# Altium project HVDC Altium.PrjPcb
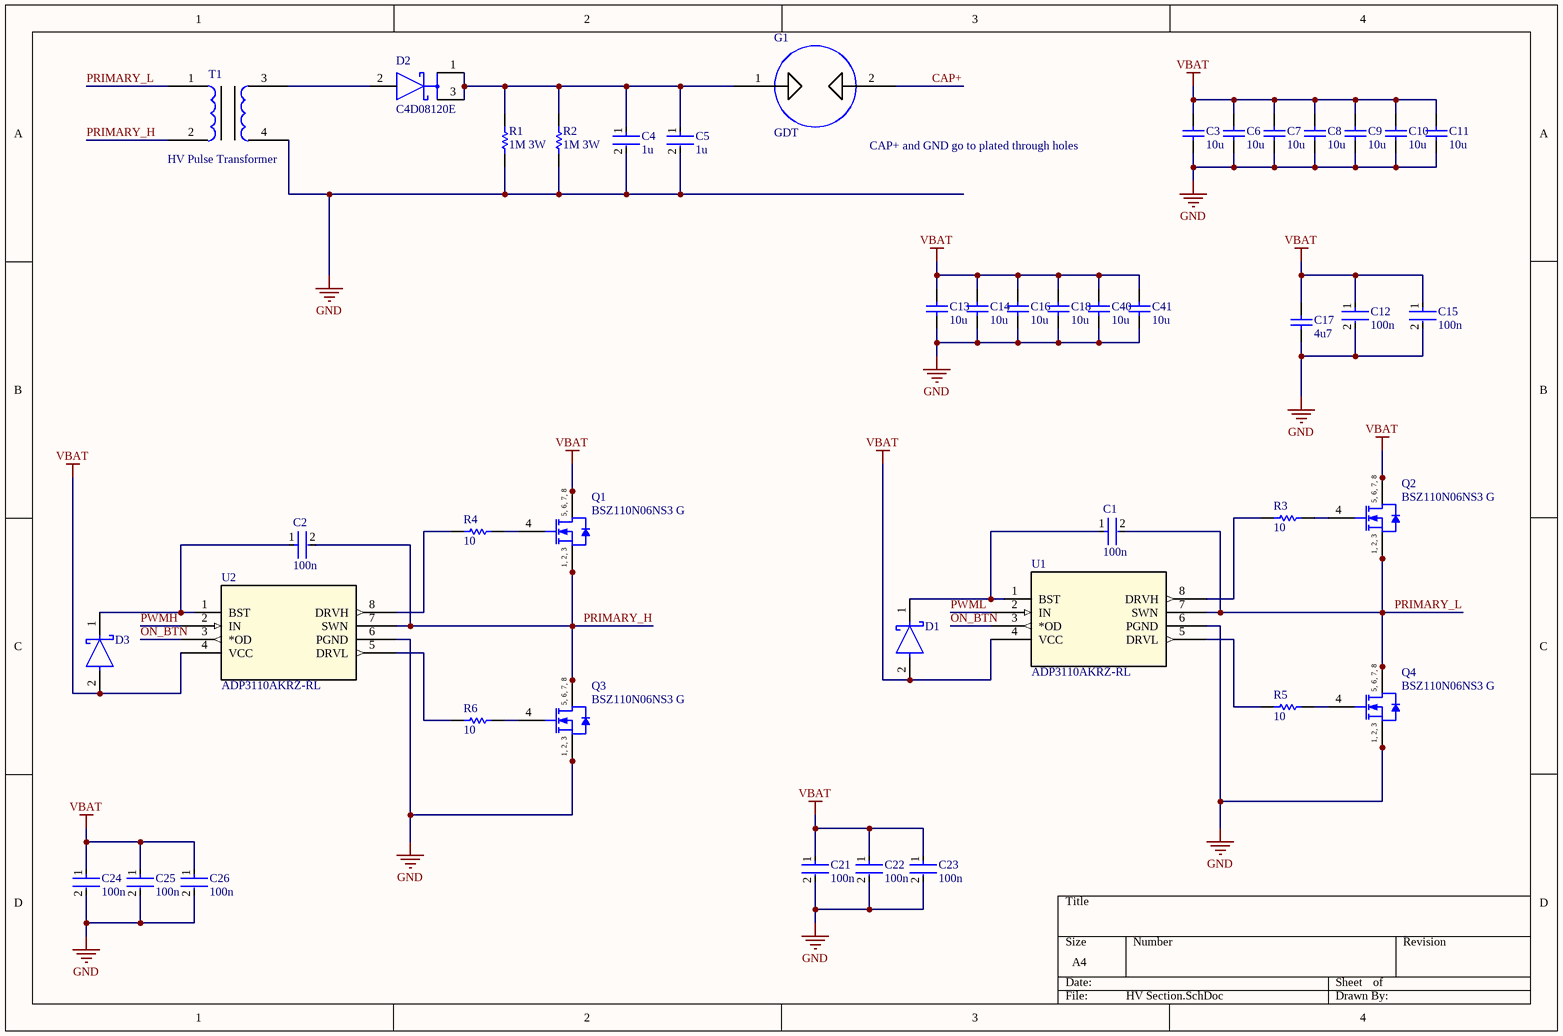
[diagram p0: HV Section.SchDoc]
3 sheets, 87 parts. Net scope: global (net labels, ports and power ports of the same name join across sheets).
Board file: PCB1.PcbDoc
Sheets:
  HV Section.SchDoc
  STM32.SchDoc
  Power.SchDoc

## Sheet HV Section.SchDoc
size A4; SheetNumber: 1; SheetTotal: 2

### Parts
C1  100n  [FP-GRM188-0_1-e0_2_0_55-IPC_A]
C2  100n  [FP-GRM188-0_1-e0_2_0_55-IPC_A]
C3  10u  [CAPC2013X145X50ML20T25]
C4  1u  [FP-C4AQSBU4100A1WJ-MFG]
C5  1u  [FP-C4AQSBU4100A1WJ-MFG]
C6  10u  [CAPC2013X145X50ML20T25]
C7  10u  [CAPC2013X145X50ML20T25]
C8  10u  [CAPC2013X145X50ML20T25]
C9  10u  [CAPC2013X145X50ML20T25]
C10  10u  [CAPC2013X145X50ML20T25]
C11  10u  [CAPC2013X145X50ML20T25]
C12  100n  [FP-GRM188-0_1-e0_2_0_55-IPC_A]
C13  10u  [CAPC2013X145X50ML20T25]
C14  10u  [CAPC2013X145X50ML20T25]
C15  100n  [FP-GRM188-0_1-e0_2_0_55-IPC_A]
C16  10u  [CAPC2013X145X50ML20T25]
C17  4u7  [CAPC2013X145X50ML20T25]
C18  10u  [CAPC2013X145X50ML20T25]
C21  100n  [FP-GRM188-0_1-e0_2_0_55-IPC_A]
C22  100n  [FP-GRM188-0_1-e0_2_0_55-IPC_A]
C23  100n  [FP-GRM188-0_1-e0_2_0_55-IPC_A]
C24  100n  [FP-GRM188-0_1-e0_2_0_55-IPC_A]
C25  100n  [FP-GRM188-0_1-e0_2_0_55-IPC_A]
C26  100n  [FP-GRM188-0_1-e0_2_0_55-IPC_A]
C40  10u  [CAPC2013X145X50ML20T25]
C41  10u  [CAPC2013X145X50ML20T25]
D1  SD0603S040S0R2  [FP-SD0603-MFG]  (value not drawn)
D2  C4D08120E  [FP-TO-252-2_v2-MFG]
D3  SD0603S040S0R2  [FP-SD0603-MFG]  (value not drawn)
G1  GDT  [2039-110-SM-RPLF]
Q1  BSZ110N06NS3 G  [INF-PG-TSDSON-8-21_V]
Q2  BSZ110N06NS3 G  [INF-PG-TSDSON-8-21_V]
Q3  BSZ110N06NS3 G  [INF-PG-TSDSON-8-21_V]
Q4  BSZ110N06NS3 G  [INF-PG-TSDSON-8-21_V]
R1  1M 3W  [RESC2512(6432)_L]
R2  1M 3W  [RESC2512(6432)_L]
R3  10  [RESC1608X55X25ML10T15]
R4  10  [RESC1608X55X25ML10T15]
R5  10  [RESC1608X55X25ML10T15]
R6  10  [RESC1608X55X25ML10T15]
T1  HV Pulse Transformer  [HV Pulse Transformer Footprint]
U1  ADP3110AKRZ-RL  [SOIC8_ONS]
U2  ADP3110AKRZ-RL  [SOIC8_ONS]

### Nets
GND: C3.1 C4.2 C5.2 C6.1 C7.1 C8.1 C9.1 C10.1 C11.1 C12.2 C13.1 C14.1 C15.2 C16.1 C17.1 C18.1 C21.2 C22.2 C23.2 C24.2 C25.2 C26.2 C40.1 C41.1 Q3.1(SOURCE) Q3.2(SOURCE) Q3.3(SOURCE) Q4.1(SOURCE) Q4.2(SOURCE) Q4.3(SOURCE) R1.1 R2.1 T1.4 U1.6(PGND) U2.6(PGND)
VBAT: C3.2 C6.2 C7.2 C8.2 C9.2 C10.2 C11.2 C12.1 C13.2 C14.2 C15.1 C16.2 C17.2 C18.2 C21.1 C22.1 C23.1 C24.1 C25.1 C26.1 C40.2 C41.2 D1.2(A) D3.2(A) Q1.5(DRAIN) Q1.6(DRAIN) Q1.7(DRAIN) Q1.8(DRAIN) Q2.5(DRAIN) Q2.6(DRAIN) Q2.7(DRAIN) Q2.8(DRAIN) U1.4(VCC) U2.4(VCC)
CAP+: G1.2
ON_BTN: U1.3(*OD) U2.3(*OD)
PRIMARY_H: C2.2 Q1.1(SOURCE) Q1.2(SOURCE) Q1.3(SOURCE) Q3.5(DRAIN) Q3.6(DRAIN) Q3.7(DRAIN) Q3.8(DRAIN) T1.2 U2.7(SWN)
PRIMARY_L: C1.2 Q2.1(SOURCE) Q2.2(SOURCE) Q2.3(SOURCE) Q4.5(DRAIN) Q4.6(DRAIN) Q4.7(DRAIN) Q4.8(DRAIN) T1.1 U1.7(SWN)
PWMH: U2.2(IN)
PWML: U1.2(IN)
NetC1_1: C1.1 D1.1(C) U1.1(BST)
NetC2_1: C2.1 D3.1(C) U2.1(BST)
NetC4_1: C4.1 C5.1 D2.1(C) D2.3(C) G1.1 R1.2 R2.2
NetD2_2: D2.2(A) T1.3
NetQ1_4: Q1.4(GATE) R4.2
NetQ2_4: Q2.4(GATE) R3.2
NetQ3_4: Q3.4(GATE) R6.2
NetQ4_4: Q4.4(GATE) R5.2
NetR3_1: R3.1 U1.8(DRVH)
NetR4_1: R4.1 U2.8(DRVH)
NetR5_1: R5.1 U1.5(DRVL)
NetR6_1: R6.1 U2.5(DRVL)

### Notes on the sheet
- CAP+ and GND go to plated through holes
- (in symbol CMP-1091-00315-1) 5, 6, 7, 8; 1, 2, 3

### Library data of the parts
C1 C2 C12 C15 C21-C26 = CMP-2006-02792-2: Chip Multilayer Ceramic Capacitors for General Purpose, 0603, 10uF, X5R, 15%, 20%, 6.3V; Packaging: Tape and Reel; Voltage Rating (DC): 6.3V; Width: 0.031inch; Termination: SMD/SMT; Dielectric: X5R; Package Quantity: 4000; Voltage Rating: 6.3V; Capacitance: 10uF; Case/Package: 0603; Min Operating Temperature: -55°C; Voltage: 6.3V; Length: 1.6mm; Thickness: 0.035inch; Lead Free: Lead Free; Depth: 0.8mm; Case Code (Imperial): 0603; Max Operating Temperature: 85°C; Material: Ceramic; Height: 0.8mm; Tolerance: 20%; Mount: Surface Mount; REACH SVHC: No SVHC; Radiation Hardening: No; Case Code (Metric): 1608
C3 C6-C11 C13 C14 C16-C18 C40 C41 = CMP-1036-04819-2: Part Number: C0805C225K9PACTU; Manufacturer: Kemet
C4 C5 = CMP-00212-89953900-1: C4AQSBU4100A1WJ Cap Film 1uF 1500V Polypropylene 5% Molded 27.5mm 105°C; Voltage Rating: 1.5kV; Voltage Rating (DC): 1.5V; Capacitance: 1µF; NexarPartId: 89953900; Min Operating Temperature: -55°C; Max Operating Temperature: 105°C; Case/Package: Radial; Height: 20.2mm; Schedule B: 8532250070; Tolerance: 5%
D1 D3 = CMP-04549-000001-1: DIODE SCHOTTKY 40V 200MA 0603; Manufacturer: AVX; Max Surge Forward Current: 2A; Forward Current: 0.2A; Lead Free: Yes; Reverse Voltage: 40V; Temperature Range Low: -55°C; Device Class L1: Discrete Semiconductors; Category: Diode; ComponentLink2URL: http://datasheets.avx.com/schottky.pdf; Device Class L3: Schottky Diodes; Automotive: No; Temperature Range High: +125°C; Digikey Description: DIODE SCHOTTKY 40V 200MA 0603; Device Class L2: Diodes; ComponentLink2Description: Datasheet; Max Repetitive Reverse Voltage: 40V; Mouser Description: Schottky Diodes & Rectifiers 40volts 0.2A SIZE 0603; Height: 0.86mm; Temperature: -55°C to +125°C; Manufacturer Part Number: SD0603S040S0R2; Package: SD0603; RoHS: TRUE; Octopart: https://octopart.com/sd0603s040s0r2-avx-24931763
D2 = CMP-240925-000081-2: DIODE SCHOTTKY 1.2KV 8A TO252-2; Max Surge Current: 64A; Max Reverse Leakage Current: 35uA; Forward Current: 24.5A; Max Power Dissipation: 136W; Reverse Recovery Time: 0ns; Forward Voltage: 1.8V; Element Configuration: Single; Mount: Surface Mount; Min Operating Temperature: -55°C; Case/Package: TO-252; Peak Non-Repetitive Surge Current: 64A; Max Repetitive Reverse Voltage (Vrrm): 1.2kV; Max Forward Surge Current (Ifsm): 64A; Max Reverse Voltage (DC): 1.2kV; Package Quantity: 75; Average Rectified Current: 24.5A; Max Operating Temperature: 175°C; Series: Z-Rec®; Number of Pins: 3; RoHS Compliant: Yes; Packaging: Rail/Tube
Q1-Q4 = CMP-1091-00315-1: N-Channel OptiMOS 3 Power-Transistor, 60 V VDS, 20 A ID, -55 to 150 degC, PG-TSDSON-8-21, Reel, Green; Manufacturer: Infineon; Green: TRUE; ID (max): 20Â A; Ptot (max): 50Â W; QG: 25Â nC; Rth: 2.5Â K/W; IDpuls (max): 80Â A; RthJA (max): 60 K/W; VDS (max): 60Â V; VGS(th) (max): 4Â V; Polarity: N; RDS (on) (max): 11Â mOhm; VGS(th) (min): 2Â V; PackageVersion: Rev. 01, 03/2007; Mounting Technology: Surface Mount; DatasheetVersion: Rev. 2.4; ComponentLink1URL: http://www.infineon.com/; ComponentLink3Description: Package Specification; ComponentLink3URL: http://www.infineon.com/dgdl/BSZ110N06NS3_Rev2.4.pdf?folderId=db3a30431ddc9372011ebafa04517f8b&fileId=db3a30431ddc9372011ebb15d4e8001a; Packing: Reel; PartNumber: BSZ110N06NS3 G; PackageDescription: 8-Pin Plastic (Green) Small Outline Non-Leaded Package, 3.3 x 3.3 mm Body, 0.65 mm Pitch; ComponentLink2URL: http://www.infineon.com/dgdl/BSZ110N06NS3_Rev2.4.pdf?folderId=db3a30431ddc9372011ebafa04517f8b&fileId=db3a30431ddc9372011ebb15d4e8001a; PackageReference: PG-TSDSON-8-21; Halogen-free: TRUE; RthJC (max): 2.5Â K/W; ComponentLink2Description: Datasheet; ComponentLink1Description: Manufacturer URL
R1 R2 = CMP-1018-00001-1: Jumper 2512 (6432 Metric); Tolerance: None; Case-EIA: 2512; Value: 0.00 Ohm; Case-Metric: 6432; Technology: SMT; Power: None
R3-R6 = CMP-2100-03667-1: Chip Resistor, 0 Ohm, +/- 5%, 0.1 W, -55 to 155 degC, 0603 (1608 Metric), RoHS, Tape and Reel; Manufacturer: Yageo; Temperature Coefficient: 200ppm/degreesC; Voltage Rating: 50V; Power Rating: 100mW; Resistance: 0mOhm; Width: 0.8mm; Max Operating Temperature: 155degC; Tolerance: 5%; Package Reference: 0603; Height: 0.45mm; Depth: 0.8mm; Package Description: 2-Pin Surface Mount Device, Body 1.6 x 0.8 mm; Termination: SMD/SMT; Package Quantity: 5000; Case/Package: 0603; Case Code (Imperial): 0603; Radiation Hardening: No; Number of Pins: 2; Length: 1.6mm; Lead Free: LeadFree; Voltage Rating (DC): 50V; Military Standard: Not; Datasheet URL: http://www.yageo.com/NewPortal/yageodocoutput?fileName=/pdf/R-Chip/PYu-RC_Group_51_RoHS_L_5.pdf; Manufacturer URL: http://www.yageo.com/; Packaging: TapeandReel; Case Code (Metric): 1608; Min Operating Temperature: -55degC; Composition: ThickFilm; RoHSCompliant: true; Contact Plating: Tin; Datasheet Version: Rev. 5, 10/2016; REACH SVHC: NoSVHC
U1 U2 = ADP3110AKRZ-RL: No Description Available; Mfr_Name: onsemi; RefDes: RefDes; Type: Type

## Sheet STM32.SchDoc
size A4; SheetNumber: 2; SheetTotal: 3
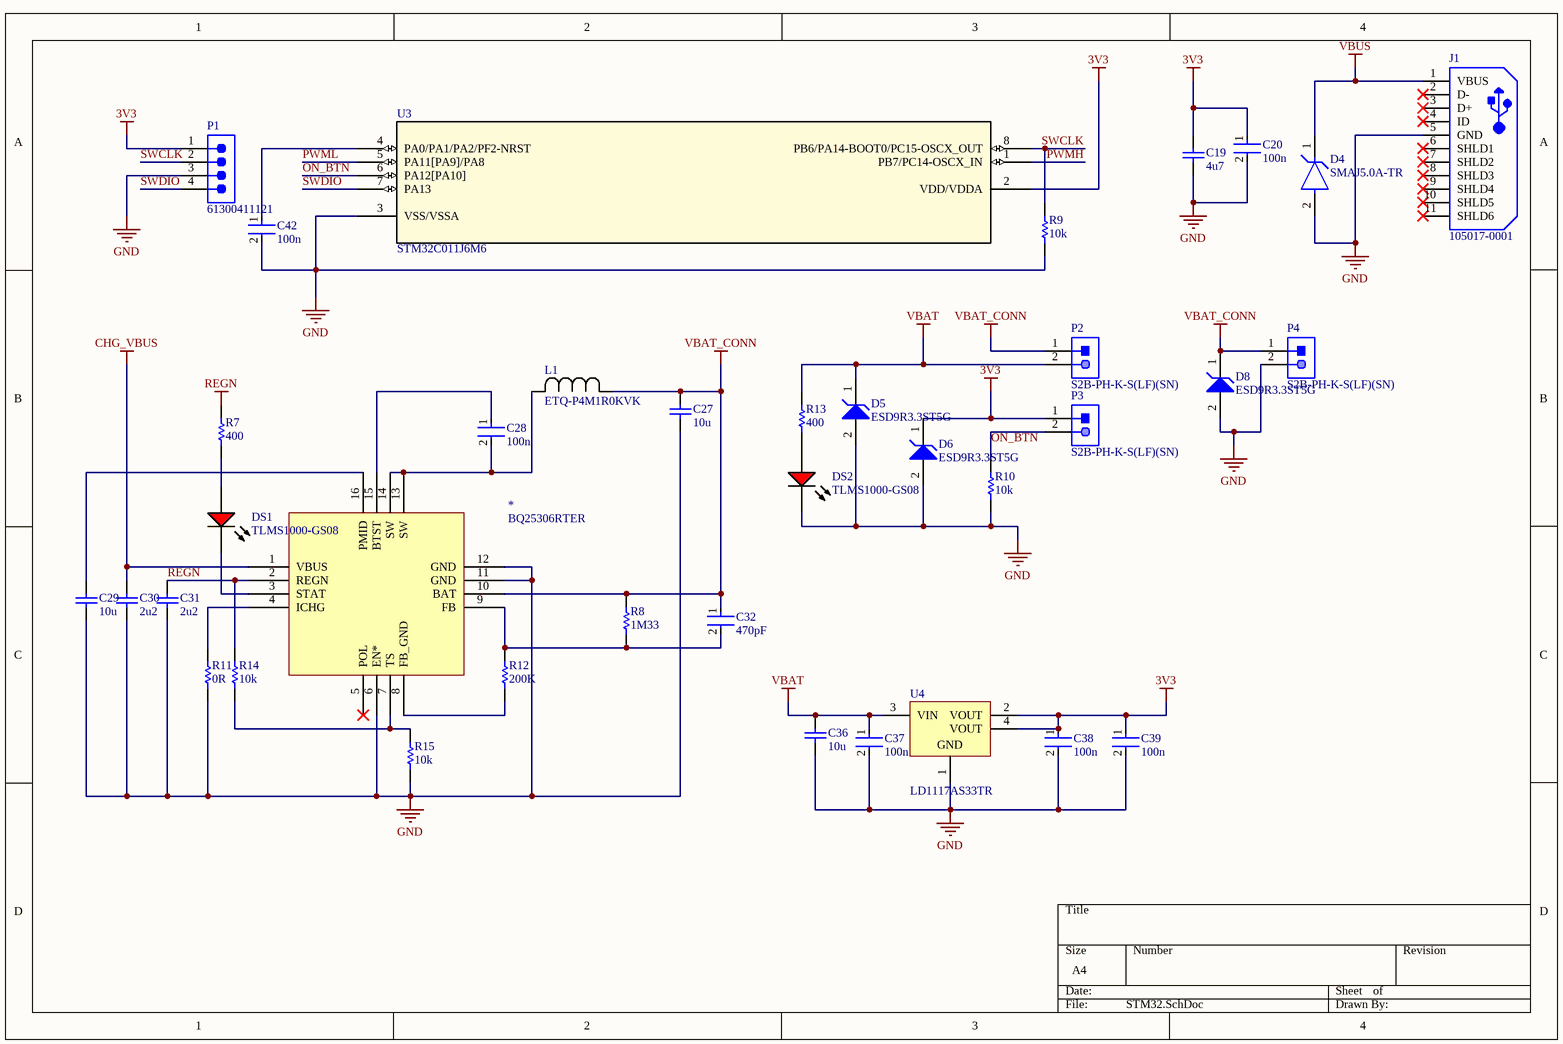
[diagram p1: STM32.SchDoc]

### Parts
*  BQ25306RTER  [BQ25306RTER]
C19  4u7  [CAPC2013X145X50ML20T25]
C20  100n  [FP-GRM188-0_1-e0_2_0_55-IPC_A]
C27  10u  [CAPC2013X145X50ML20T25]
C28  100n  [FP-GRM188-0_1-e0_2_0_55-IPC_A]
C29  10u  [CAPC2013X145X50ML20T25]
C30  2u2  [CAPC2013X145X50ML20T25]
C31  2u2  [CAPC2013X145X50ML20T25]
C32  470pF  [FP-GRM188-0_1-e0_2_0_55-IPC_A]
C36  10u  [CAPC2013X145X50ML20T25]
C37  100n  [FP-GRM188-0_1-e0_2_0_55-IPC_A]
C38  100n  [FP-GRM188-0_1-e0_2_0_55-IPC_A]
C39  100n  [FP-GRM188-0_1-e0_2_0_55-IPC_A]
C42  100n  [FP-GRM188-0_1-e0_2_0_55-IPC_A]
D4  SMAJ5.0A-TR  [FP-SMA-MFG]
D5  ESD9R3.3ST5G  [ONSC-SOD-923-2-514AB-01_V]
D6  ESD9R3.3ST5G  [ONSC-SOD-923-2-514AB-01_V]
D8  ESD9R3.3ST5G  [ONSC-SOD-923-2-514AB-01_V]
DS1  TLMS1000-GS08  [VISH-TLMS1000_V]
DS2  TLMS1000-GS08  [VISH-TLMS1000_V]
J1  105017-0001  [USB-MICRO-B_V]
L1  ETQ-P4M1R0KVK  [IND_PCC-M0840M-LP_PAN]
P1  61300411121  [61300411121]
P2  S2B-PH-K-S(LF)(SN)  [JST-S2B-PH-K-S_V]
P3  S2B-PH-K-S(LF)(SN)  [JST-S2B-PH-K-S_V]
P4  S2B-PH-K-S(LF)(SN)  [JST-S2B-PH-K-S_V]
R7  400  [RESC1608X55X25ML10T15]
R8  1M33  [RESC1608X55X25ML10T15]
R9  10k  [RESC1608X55X25ML10T15]
R10  10k  [RESC1608X55X25ML10T15]
R11  0R  [RESC1608X55X25ML10T15]
R12  200K  [RESC1608X55X25ML10T15]
R13  400  [RESC1608X55X25ML10T15]
R14  10k  [RESC1608X55X25ML10T15]
R15  10k  [RESC1608X55X25ML10T15]
U3  STM32C011J6M6  [SO-8_STM]
U4  LD1117AS33TR  [SOT-223_M]

### Nets
3V3: C19.2 C20.1 C38.1 C39.1 D6.1(K) P1.1 P3.1 U3.2(VDD/VDDA) U4.2(VOUT) U4.4(VOUT)
CHG_VBUS: *.1(VBUS) C30.2
GND: *.6(EN*) *.11(GND) *.12(GND) C19.1 C20.2 C27.1 C29.1 C30.1 C31.1 C36.1 C37.2 C38.2 C39.2 C42.2 D4.2(A) D5.2(A) D6.2(A) D8.2(A) DS2.2(K) J1.5(GND) P1.3 P4.2 R9.1 R10.2 R11.1 R15.1 U3.3(VSS/VSSA) U4.1(GND)
REGN: *.2(REGN) C31.2 R7.2 R14.2
VBAT: C36.2 C37.1 D5.1(K) P2.2 R13.2 U4.3(VIN)
VBAT_CONN: *.10(BAT) C27.2 C32.1 D8.1(K) L1.1 P2.1 P4.1 R8.2
VBUS: D4.1(K) J1.1(VBUS)
ON_BTN: P3.2 R10.1 U3.6(PA12[PA10])
PWMH: U3.1(PB7/PC14-OSCX_IN)
PWML: U3.5(PA11[PA9]/PA8)
SWCLK: P1.2 R9.2 U3.8(PB6/PA14-BOOT0/PC15-OSCX_OUT)
SWDIO: P1.4 U3.7(PA13)
Net*_3: *.3(STAT) DS1.2(K)
Net*_4: *.4(ICHG) R11.2
Net*_7: *.7(TS) R14.1 R15.2
Net*_8: *.8(FB_GND) R12.1
Net*_9: *.9(FB) C32.2 R8.1 R12.2
Net*_13: *.13(SW) *.14(SW) C28.2 L1.2
Net*_15: *.15(BTST) C28.1
Net*_16: *.16(PMID) C29.2
NetC42_1: C42.1 U3.4(PA0/PA1/PA2/PF2-NRST)
NetDS1_1: DS1.1(A) R7.1
NetDS2_1: DS2.1(A) R13.1

Not connected (* = marked no-connect by the designer): * 5(POL)*; J1 2(D-)* 3(D+)* 4(ID)* 6(SHLD1)* 7(SHLD2)* 8(SHLD3)* 9(SHLD4)* 10(SHLD5)* 11(SHLD6)*

### Library data of the parts
C19 C27 C29-C31 C36 = CMP-1036-04819-2: as C3 on sheet HV Section
C20 C28 C32 C37-C39 C42 = CMP-2006-02792-2: as C1 on sheet HV Section; Packaging: Tape and Reel; Voltage Rating (DC): 6.3V; Width: 0.031inch; Termination: SMD/SMT; Dielectric: X5R; Package Quantity: 4000; Voltage Rating: 6.3V; Capacitance: 10uF; Case/Package: 0603; Min Operating Temperature: -55°C; Voltage: 6.3V; Length: 1.6mm; Thickness: 0.035inch; Lead Free: Lead Free; Depth: 0.8mm; Case Code (Imperial): 0603; Max Operating Temperature: 85°C; Material: Ceramic; Height: 0.8mm; Tolerance: 20%; Mount: Surface Mount; REACH SVHC: No SVHC; Radiation Hardening: No; Case Code (Metric): 1608
D4 = CMP-12225-000048-1: TVS DIODE 5V 13.4V SMA; Manufacturer: STMicroelectronics; Standoff Height: 0.05mm; Max Junction Temp: +150°C; Clamping Voltage: 9.2V; Number Of Channels: 1; Peak Pulse Power: 400W; Peak Pulse Current: 43.5A; Breakdown Voltage: 6.4V; Direction: Unidirectional; ComponentLink2Description: Datasheet; Lead Free: Yes; Package: SMA; Height: 2.65mm; Mouser Description: Transient Voltage Suppressor, TVS, Transil SMAJ Series, Unidirectional, 5 V, DO-214AC, 2, 6.4 V; Manufacturer Part Number: SMAJ5.0A-TR; Reverse Standoff Voltage: 5V; Temperature Range Low: -55°C; Device Class L1: Circuit Protection; RoHS: TRUE; Category: Diode; Automotive: No; ComponentLink2URL: https://www.st.com/resource/en/datasheet/smaj.pdf; Device Class L3: unset; Device Class L2: TVS Diodes; Temperature Range High: +150°C; Octopart: https://octopart.com/smaj5.0a-tr-stmicroelectronics-347063; Digikey Description: TVS DIODE 5V 13.4V SMA; Temperature: -55°C to +150°C
D5 D6 D8 = CMP-1063-00117-1: Transient Voltage Suppressor, ESD Protection Diode with Ultra-Low Leakage, 2-Pin SOD-923, Pb-Free, Tape and Reel; Manufacturer: On Semiconductor; C Max (pF): 0.9; V(BR) Min (V): 4.8; Number of Lines: 1; Direction: Unidirectional; IR Max (uA): 0.001; VRWM Max (V): 3.3; PackageReference: SOD-923-2-514AB-01; ComponentLink3URL: http://www.onsemi.com/pub_link/Collateral/514AB.PDF; DatasheetVersion: Rev. 1; PackageDescription: 2-Pin SOD, Body 0.8 x 0.6 mm; ComponentLink1URL: http://www.onsemi.com/; ComponentLink2Description: Datasheet; ComponentLink3Description: Package Specification; Packing: Tape and Reel; ComponentLink1Description: Manufacturer URL; ComponentLink2URL: http://www.onsemi.com/pub_link/Collateral/ESD9R3.3S-D.PDF; RoHS: Pb-Free; PackageVersion: Rev. C, 03/2011; Mounting Technology: Surface Mount; PartNumber: ESD9R3.3ST5G
DS1 DS2 = CMP-2000-07254-1: Low Current LED, 40 mW, 1.8 V, -40 to 100 degC, 2-Pin SMD (0603), RoHS, Tape and Reel; Manufacturer: Vishay; Lens Shape: Rectangular; Automotive Qualification Standard: AEC-Q100; Wavelength Typ: 636nm; SVHC: ToBeAdvised; LED Colour: Red; Bulb Size: 1.6mmx0.8mm; Forward Voltage: 1.8V; Luminous Intensity: 4mcd; Forward Current If: 2mA; Viewing Angle: 80°; Datasheet Version: Rev. 1.7, 02/2011; Datasheet URL: https://datasheet.ciiva.com/5798/1698881-5798337.pdf; LED Mounting: SMD; Packaging: CutTape; Package Reference: TLMS1000; Manufacturer URL: http://www.vishay.com/; Mounting Technology: SurfaceMount; Product Range: -; Package Description: 2-Pin Surface Mount Device, Body 1.6 x 0.8 mm; MSL: MSL2-1year
J1 = CMP-2000-05827-1: Micro-USB B Receptacle, Right Angle, Bottom Mount, Surface Mount, with Solder Tabs, -30 to 85 degC, 5-Pin USB, RoHS, Tape and Reel; Manufacturer: Molex; Featured Product: Micro-USBConnectorsUSBConnectors; Other Names: WM1399DKR; Package Version: Rev. F, 12/2012; Number of Contacts: 5; Connector Type: USB-microB; Catalog Drawings: 1050170001; 3D Model: 105017-0001.stp; Mating Products: WM17145-ND-CABLEMICROUSBBTOSTDA1.0MWM17147-ND-CABLEMICROUSBBTOSTDA2.0MWM17146-ND-CABLEMICROUSBBTOSTDA1.5M; PCN Assembly/Origin: ResinSupplier21/Oct/2015; Voltage - Max: 30V; Online Catalog: Molex-MicroUSB; Manufacturer URL: http://www.molex.com/; Package Description: 5-Leads USB, Micro B, Body 7.5 x 5 mm, Pitch 0.65 mm; Datasheet URL: http://www.molex.com/elqNow/elqRedir.htm?ref=http://www.molex.com/webdocs/datasheets/pdf/en-us/1050170001_IO_CONNECTORS.pdf; Ingress Protection: -; Datasheet Version: 03/2016; Mounting Type: BoardCutout,SurfaceMount,RightAngle; Circuits: 5; Standard Package: 1; Package Reference: MICRO-B; Package URL: http://www.molex.com/pdm_docs/sd/1050170001_sd.pdf; Category: Connectors,Interconnects; Series: -; RoHS Information: 1050170001CertofCompliance; Features: Shielded,SolderRetention; Family: USB,DVI,HDMIConnectors; Specifications: -; Gender: Receptacle; Packaging: Digi-Reel®; Mounting Technology: SurfaceMount
L1 = ETQ-P4M1R0KVK: No Description Available; Mfr_Name: Panasonic
P1 = CMP-1502-01064-3: NexarPartId: 32855522; Operating Supply Voltage: 250V; Pitch: 2.54mm; Contact Resistance: 20mΩ; Number of Positions: 4; Current Rating: 3A; Connector Type: Male Pin; Gender: Male; Contact Plating: Gold; Height: 8.89mm; Lead Pitch: 2.54mm; Lead Free: Lead Free; Contact Mating Length: 5.9944mm; Number of Rows: 1; Termination: Solder; Packaging: Bulk; REACH SVHC: Unknown; Min Operating Temperature: -40°C; RoHS: Compliant; Number of Contacts: 4; Voltage Rating: 250V; Color: Black; Max Operating Temperature: 105°C; Contact Material: Copper; Mount: Through Hole; Orientation: Vertical; Number of Pins: 4
P2-P4 = CMP-1755-00004-1: Male Header, Pitch 2 mm, 1 x 2 Position, Height 4.8 mm, Tail Length 3.4 mm, -25 to 85 degC, RoHS, Bulk; Case\Package: Radial; Tolerance: 20%; Capacitance: 10 uF; Voltage Rating (DC): 50 V; Packaging: Bulk; ComponentLink1URL: http://www.jst-mfg.com/product/pdf/eng/ePH.pdf; Radiation Hardening: No; Height: 11 mm; Package Quantity: 200; PackageDescription: Male Header, Pitch 2 mm, 1 x 2 Position, Height 4.8 mm, Tail Length 3.4 mm; PackageReference: S2B-PH-K-S; Diameter: 5 mm; Pins: 2; Mount: Through Hole; Max Operating Temperature: 85 degC; Min Operating Temperature: -40 degC; ComponentLink1Description: Datasheet; DatasheetVersion: Dec-12; Length: 11 mm; Lead Pitch: 2 mm; REACH SVHC: No SVHC; Voltage Rating: 50 V; RoHSCompliant: true
R7-R15 = CMP-2100-03667-1: as R3 on sheet HV Section; Width: 0.8mm; Max Operating Temperature: 155degC; Tolerance: 5%; Package Reference: 0603; Height: 0.45mm; Depth: 0.8mm; Package Description: 2-Pin Surface Mount Device, Body 1.6 x 0.8 mm; Termination: SMD/SMT; Package Quantity: 5000; Case/Package: 0603; Case Code (Imperial): 0603; Radiation Hardening: No; Number of Pins: 2; Length: 1.6mm; Lead Free: LeadFree; Voltage Rating (DC): 50V; Military Standard: Not; Datasheet URL: http://www.yageo.com/NewPortal/yageodocoutput?fileName=/pdf/R-Chip/PYu-RC_Group_51_RoHS_L_5.pdf; Manufacturer URL: http://www.yageo.com/; Packaging: TapeandReel; Case Code (Metric): 1608; Min Operating Temperature: -55degC; Composition: ThickFilm; RoHSCompliant: true; Contact Plating: Tin; Datasheet Version: Rev. 5, 10/2016; REACH SVHC: NoSVHC
U3 = STM32C011J6M6: No Description Available; Mfr_Name: STMicroelectronics; RefDes: RefDes; Type: Type
U4 = CMP-0244-00316-1: 1A, Low Drop Positive Voltage Regulator, 3.3V, 4-Pin SOT-223, Tape and Reel; ComponentLink1Description: Manufacturer URL; DatasheetVersion: 2/12/2011; PackageVersion: 2010; ComponentLink1URL: http://www.st.com; ComponentLink2Description: Datasheet; ComponentLink2URL: http://www.st.com/internet/com/TECHNICAL_RESOURCES/TECHNICAL_LITERATURE/DATASHEET/CD00002116.pdf; PackageDescription: 4-Pin SOT-223 Package, 6.5 x 3.5 mm Body, 2.3 mm Pitch, 7 mm Lead Span; PackageReference: SOT-223

## Sheet Power.SchDoc
size A4; SheetNumber: 3; SheetTotal: 3
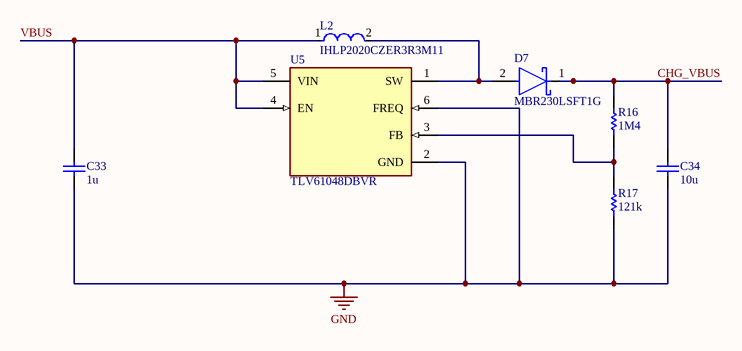
[diagram p2: Power.SchDoc]

### Parts
C33  1u  [CAPC2013X145X50ML20T25]
C34  10u  [CAPC2013X145X50ML20T25]
D7  MBR230LSFT1G  [FP-498-MFG]
L2  IHLP2020CZER3R3M11  [FP-IHLP-2020CZ-FP_1_905x2-MFG]
R16  1M4  [RESC1608X55X25ML10T15]
R17  121k  [RESC1608X55X25ML10T15]
U5  TLV61048DBVR  [FP-DBV0006A-IPC_B]

### Nets
CHG_VBUS: C34.2 D7.1(C) R16.2
GND: C33.1 C34.1 R17.1 U5.2(GND) U5.6(FREQ)
VBUS: C33.2 L2.1 U5.4(EN) U5.5(VIN)
NetD7_2: D7.2(A) L2.2 U5.1(SW)
NetR16_1: R16.1 R17.2 U5.3(FB)

### Library data of the parts
C33 C34 = CMP-1036-04819-2: as C3 on sheet HV Section
D7 = CMP-1055-00442-2: DIODE SCHOTTKY 30V 2A SOD123L; Max Forward Surge Current (Ifsm): 40A; Element Configuration: Single; Forward Voltage: 430mV; Peak Reverse Current: 1mA; Max Reverse Voltage (DC): 30V; Max Operating Temperature: 125°C; Max Repetitive Reverse Voltage (Vrrm): 30V; Forward Current: 2A; Package Quantity: 1; Height: 0.9mm; REACH SVHC: No SVHC; Contact Plating: Tin; Min Operating Temperature: -55°C; Lead Free: Lead Free; Average Rectified Current: 2A; Halogen Free: Halogen Free; Peak Non-Repetitive Surge Current: 40A; Radiation Hardening: No; Case/Package: SOD; Number of Pins: 2; Packaging: Tape and Reel; Width: 1.8mm; Length: 2.9mm
L2 = CMP-02424-000463-1: Fixed Inductors Commercial Low DCR Series 3.3uH 5.5A 40.4mΩ 20%; DC Resistance (DCR): 40.4mR; Self Resonant Frequency: 29MHz; Saturation Current: 7A; Test Frequency: 100kHz; Shielding: Shielded; Depth: 5.43mm; Inductance: 3.3uH; Termination: SMD/SMT; Width: 0.204inch; Packaging: Tape and Reel; Height: 3mm; Height - Seated (Max): 0.118inch; Military Standard: Not; RMS Current (Irms): 5.5A; Current Rating: 5.5A; Radiation Hardening: No; Case/Package: 2020; Tolerance: 20%; Min Operating Temperature: -55°C; Package Quantity: 2000; Contact Plating: Tin; Mount: Surface Mount; Inductance Tolerance: 20%; Length: 5.74mm; Lead Free: Lead Free; Max DC Current: 7A; Max Operating Temperature: 125°C
R16 R17 = CMP-2100-03667-1: as R3 on sheet HV Section; Width: 0.8mm; Max Operating Temperature: 155degC; Tolerance: 5%; Package Reference: 0603; Height: 0.45mm; Depth: 0.8mm; Package Description: 2-Pin Surface Mount Device, Body 1.6 x 0.8 mm; Termination: SMD/SMT; Package Quantity: 5000; Case/Package: 0603; Case Code (Imperial): 0603; Radiation Hardening: No; Number of Pins: 2; Length: 1.6mm; Lead Free: LeadFree; Voltage Rating (DC): 50V; Military Standard: Not; Datasheet URL: http://www.yageo.com/NewPortal/yageodocoutput?fileName=/pdf/R-Chip/PYu-RC_Group_51_RoHS_L_5.pdf; Manufacturer URL: http://www.yageo.com/; Packaging: TapeandReel; Case Code (Metric): 1608; Min Operating Temperature: -55degC; Composition: ThickFilm; RoHSCompliant: true; Contact Plating: Tin; Datasheet Version: Rev. 5, 10/2016; REACH SVHC: NoSVHC
U5 = CMP-04918-000262-1: IC REG BOOST ADJ SOT23-6

## Nets that join several sheets
CHG_VBUS: STM32 (*.1 C30.2), Power (C34.2 D7.1 R16.2)
GND: HV Section (35 pins), STM32 (28 pins), Power (5 pins)
VBAT: HV Section (34 pins), STM32 (6 pins)
VBUS: STM32 (D4.1 J1.1), Power (C33.2 L2.1 U5.4 U5.5)
ON_BTN: HV Section (U1.3 U2.3), STM32 (P3.2 R10.1 U3.6)
PWMH: HV Section (U2.2), STM32 (U3.1)
PWML: HV Section (U1.2), STM32 (U3.5)